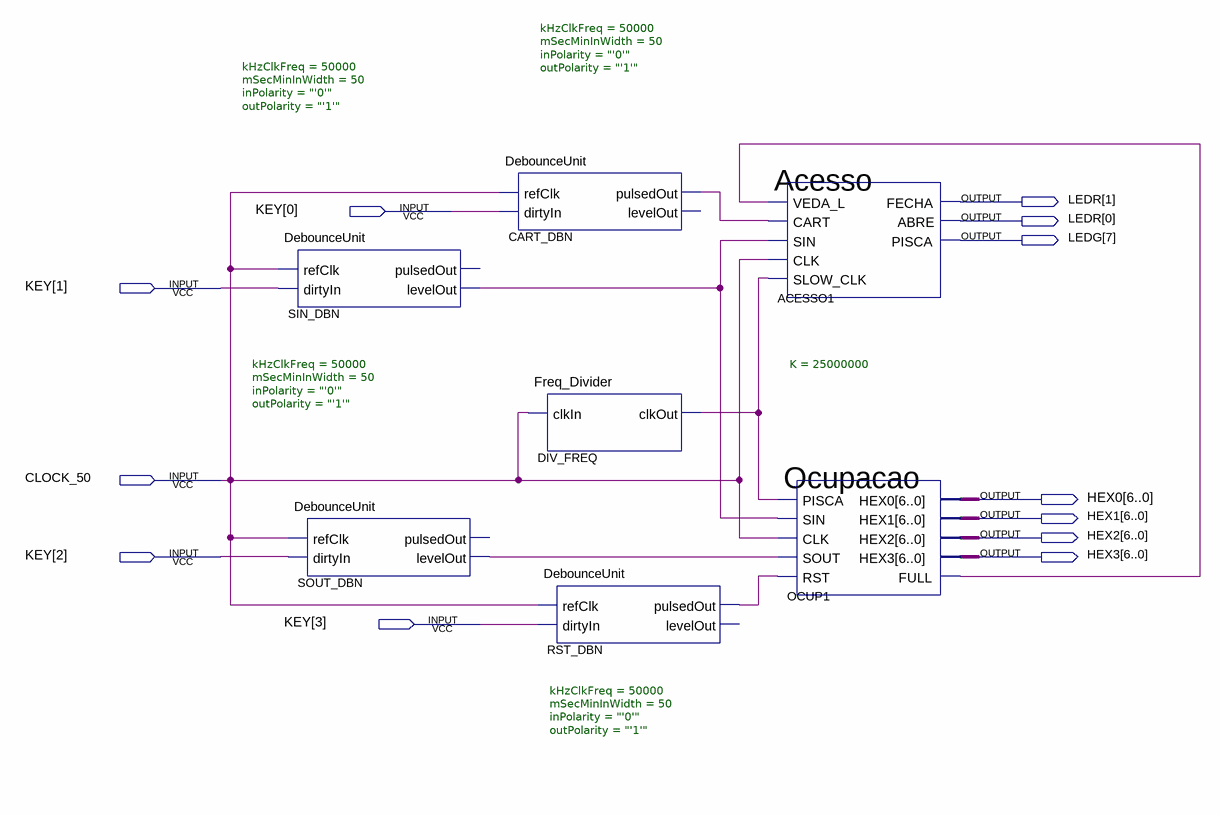
[diagram p0: schematic sheet]
// Quartus schematic Parque.bdf as structural Verilog: 7 symbols, 12 pins
module Parque (
  input  [3:0] KEY,
  input  CLOCK_50,
  output [1:0] LEDR,
  output [7:7] LEDG,
  output [6:0] HEX0,
  output [6:0] HEX1,
  output [6:0] HEX2,
  output [6:0] HEX3
);

  wire CART_DBN_pulsedout, DIV_FREQ_clkout, OCUP1_full, RST_DBN_pulsedout, SIN_DBN_levelout,
       SOUT_DBN_levelout;

  DebounceUnit #(.kHzClkFreq(50000), .mSecMinInWidth(50), .inPolarity("'0'"), .outPolarity("'1'")) SIN_DBN (
    .refClk(CLOCK_50), .dirtyIn(KEY[1]), .levelOut(SIN_DBN_levelout));  // open: pulsedOut
  DebounceUnit #(.kHzClkFreq(50000), .mSecMinInWidth(50), .inPolarity("'0'"), .outPolarity("'1'")) SOUT_DBN (
    .refClk(CLOCK_50), .dirtyIn(KEY[2]), .levelOut(SOUT_DBN_levelout));  // open: pulsedOut
  DebounceUnit #(.kHzClkFreq(50000), .mSecMinInWidth(50), .inPolarity("'0'"), .outPolarity("'1'")) CART_DBN (
    .refClk(CLOCK_50), .dirtyIn(KEY[0]), .pulsedOut(CART_DBN_pulsedout));  // open: levelOut
  Freq_Divider #(.K(25000000)) DIV_FREQ (.clkIn(CLOCK_50), .clkOut(DIV_FREQ_clkout));
  DebounceUnit #(.kHzClkFreq(50000), .mSecMinInWidth(50), .inPolarity("'0'"), .outPolarity("'1'")) RST_DBN (
    .refClk(CLOCK_50), .dirtyIn(KEY[3]), .pulsedOut(RST_DBN_pulsedout));  // open: levelOut
  Acesso ACESSO1 (
    .VEDA_L(OCUP1_full), .CART(CART_DBN_pulsedout), .SIN(SIN_DBN_levelout), .CLK(CLOCK_50),
    .SLOW_CLK(DIV_FREQ_clkout), .FECHA(LEDR[1]), .ABRE(LEDR[0]), .PISCA(LEDG[7]));
  Ocupacao OCUP1 (
    .PISCA(DIV_FREQ_clkout), .SIN(SIN_DBN_levelout), .CLK(CLOCK_50), .SOUT(SOUT_DBN_levelout),
    .RST(RST_DBN_pulsedout), .HEX0(HEX0), .HEX1(HEX1), .HEX2(HEX2), .HEX3(HEX3), .FULL(OCUP1_full));
endmodule
